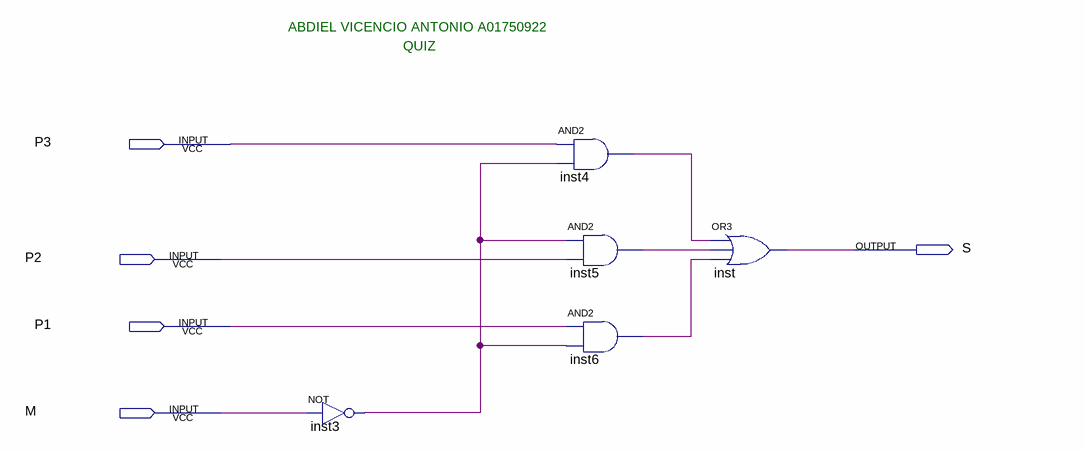
[diagram p0: schematic sheet]
// Quartus schematic QUIZ.bdf as structural Verilog: 5 symbols, 5 pins
module QUIZ (
  input  P3,
  input  P2,
  input  P1,
  input  M,
  output S
);

  wire inst3_out, inst4_out, inst5_out, inst6_out;

  not inst3 (inst3_out, M);
  and inst4 (inst4_out, P3, inst3_out);
  and inst5 (inst5_out, inst3_out, P2);
  and inst6 (inst6_out, P1, inst3_out);
  or inst (S, inst4_out, inst5_out, inst6_out);

  // Notes on the sheet:
  //   ABDIEL VICENCIO ANTONIO A01750922
  //   QUIZ
endmodule
